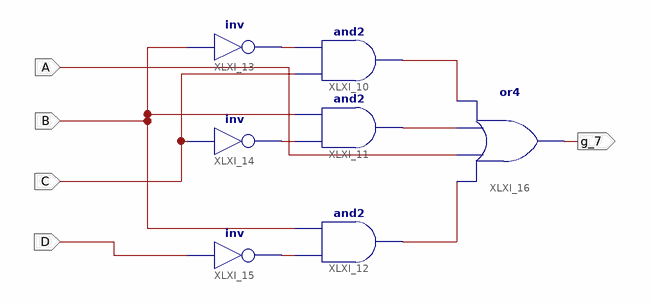
[diagram p0: schematic sheet 1]
// Xilinx ISE schematic g_7.sch (spartan6) as structural Verilog: 7 symbols, 5 ports
module g_7 (
  input  A,
  input  B,
  input  C,
  input  D,
  output g_7
);

  wire XLXN_23, XLXN_24, XLXN_25, XLXN_28, XLXN_29, XLXN_30;

  and XLXI_10 (XLXN_28, C, XLXN_23);
  and XLXI_11 (XLXN_29, XLXN_24, B);
  and XLXI_12 (XLXN_30, XLXN_25, B);
  not XLXI_13 (XLXN_23, B);
  not XLXI_14 (XLXN_24, C);
  not XLXI_15 (XLXN_25, D);
  or XLXI_16 (g_7, XLXN_30, A, XLXN_29, XLXN_28);
endmodule
